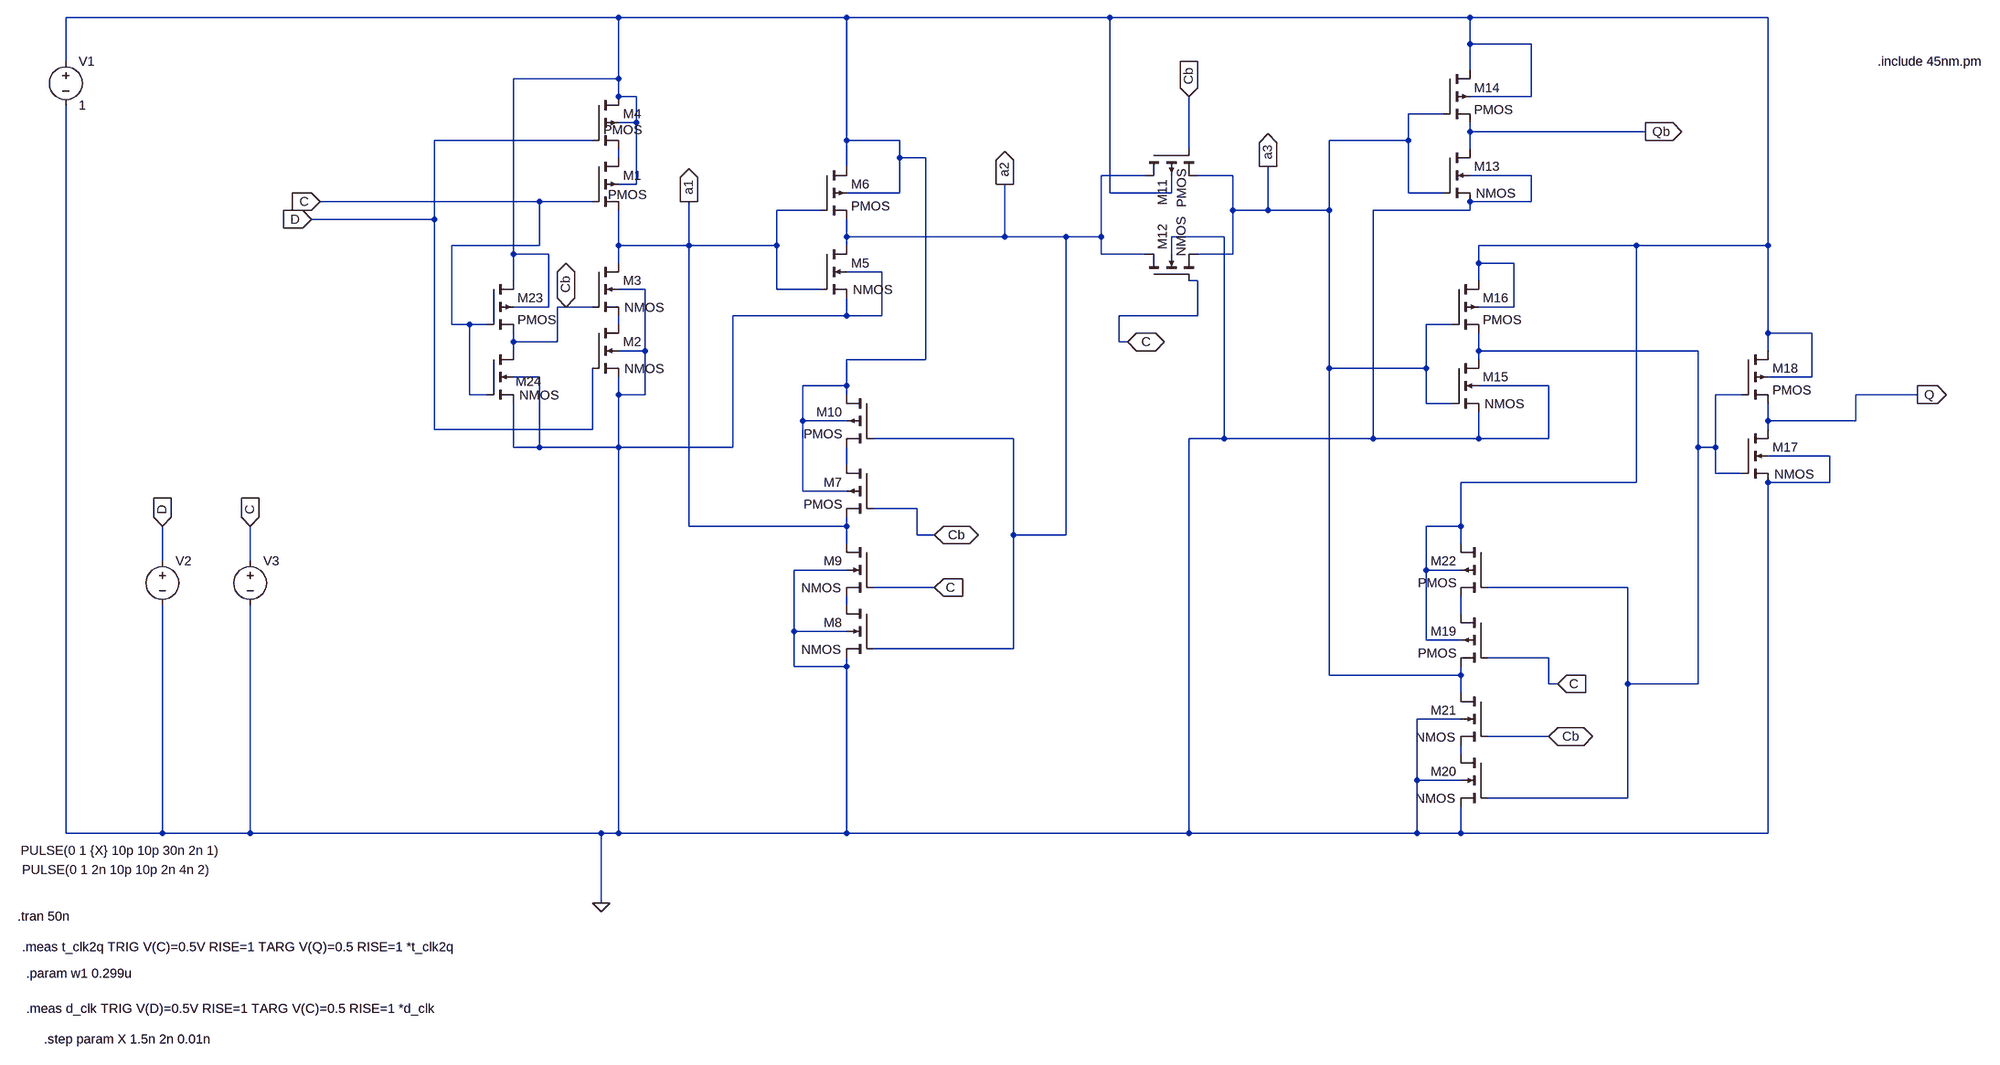
[diagram p0: schematic new1-setup.asc]
new1-setup.asc, the LTspice schematic file:
Version 4
SHEET 1 2344 680
WIRE -160 -1200 -1168 -1200
WIRE 256 -1200 -160 -1200
WIRE 736 -1200 256 -1200
WIRE 1392 -1200 736 -1200
WIRE 1936 -1200 1392 -1200
WIRE 1392 -1152 1392 -1200
WIRE 1504 -1152 1392 -1152
WIRE -1168 -1120 -1168 -1200
WIRE 1392 -1104 1392 -1152
WIRE -160 -1088 -160 -1200
WIRE -160 -1088 -352 -1088
WIRE -160 -1056 -160 -1088
WIRE -128 -1056 -160 -1056
WIRE 1504 -1056 1504 -1152
WIRE 1504 -1056 1392 -1056
WIRE 1344 -1024 1280 -1024
WIRE -128 -1008 -128 -1056
WIRE -128 -1008 -160 -1008
WIRE 1392 -992 1392 -1008
WIRE 1712 -992 1392 -992
WIRE -208 -976 -496 -976
WIRE 256 -976 256 -1200
WIRE 352 -976 256 -976
WIRE 1280 -976 1280 -1024
WIRE 1280 -976 1136 -976
WIRE 880 -960 880 -1056
WIRE 1392 -960 1392 -992
WIRE -160 -944 -160 -960
WIRE 352 -944 352 -976
WIRE 400 -944 352 -944
WIRE 256 -928 256 -976
WIRE 800 -912 720 -912
WIRE 960 -912 896 -912
WIRE 1504 -912 1392 -912
WIRE -128 -896 -128 -1008
WIRE -128 -896 -160 -896
WIRE 352 -880 352 -944
WIRE 352 -880 256 -880
WIRE 736 -880 736 -1200
WIRE 848 -880 848 -912
WIRE 848 -880 736 -880
WIRE 1280 -880 1280 -976
WIRE 1344 -880 1280 -880
WIRE -304 -864 -704 -864
WIRE -208 -864 -304 -864
WIRE 1504 -864 1504 -912
WIRE 1504 -864 1392 -864
WIRE 208 -848 128 -848
WIRE 960 -848 960 -912
WIRE 1024 -848 1024 -928
WIRE 1024 -848 960 -848
WIRE 1136 -848 1136 -976
WIRE 1136 -848 1024 -848
WIRE 1392 -848 1392 -864
WIRE 1392 -848 1216 -848
WIRE -496 -832 -496 -976
WIRE -496 -832 -720 -832
WIRE 256 -800 256 -832
WIRE 544 -800 544 -896
WIRE 544 -800 256 -800
WIRE 656 -800 544 -800
WIRE 720 -800 720 -912
WIRE 720 -800 656 -800
WIRE 944 -800 848 -800
WIRE -304 -784 -304 -864
WIRE -304 -784 -464 -784
WIRE -160 -784 -160 -848
WIRE -32 -784 -32 -864
WIRE -32 -784 -160 -784
WIRE 128 -784 128 -848
WIRE 128 -784 -32 -784
WIRE 256 -784 256 -800
WIRE 1696 -784 1408 -784
WIRE 1936 -784 1936 -1200
WIRE 1936 -784 1696 -784
WIRE -352 -768 -352 -1088
WIRE -288 -768 -352 -768
WIRE 720 -768 720 -800
WIRE 800 -768 720 -768
WIRE 848 -768 848 -800
WIRE 960 -768 960 -848
WIRE 960 -768 896 -768
WIRE -160 -752 -160 -784
WIRE 1408 -752 1408 -784
WIRE 1472 -752 1408 -752
WIRE 320 -736 256 -736
WIRE -352 -720 -352 -768
WIRE 896 -720 880 -720
WIRE 1408 -720 1408 -752
WIRE -112 -704 -160 -704
WIRE 128 -704 128 -784
WIRE 208 -704 128 -704
WIRE -288 -672 -288 -768
WIRE -288 -672 -352 -672
WIRE -256 -672 -272 -672
WIRE -208 -672 -256 -672
WIRE 1472 -672 1472 -752
WIRE 1472 -672 1408 -672
WIRE 256 -656 256 -688
WIRE 256 -656 48 -656
WIRE 320 -656 320 -736
WIRE 320 -656 256 -656
WIRE 896 -656 896 -720
WIRE 896 -656 752 -656
WIRE -464 -640 -464 -784
WIRE -432 -640 -464 -640
WIRE -400 -640 -432 -640
WIRE -160 -640 -160 -656
WIRE 1360 -640 1312 -640
WIRE 1936 -624 1936 -784
WIRE 2016 -624 1936 -624
WIRE -352 -608 -352 -624
WIRE -272 -608 -272 -672
WIRE -272 -608 -352 -608
WIRE 752 -608 752 -656
WIRE 768 -608 752 -608
WIRE -352 -592 -352 -608
WIRE -112 -592 -112 -704
WIRE -112 -592 -160 -592
WIRE 1408 -592 1408 -624
WIRE 1808 -592 1408 -592
WIRE 1936 -592 1936 -624
WIRE 400 -576 400 -944
WIRE 400 -576 256 -576
WIRE 1408 -576 1408 -592
WIRE 1136 -560 1136 -848
WIRE 1312 -560 1312 -640
WIRE 1312 -560 1136 -560
WIRE -304 -544 -352 -544
WIRE 2016 -544 2016 -624
WIRE 2016 -544 1936 -544
WIRE 256 -528 256 -576
WIRE 256 -528 176 -528
WIRE 1536 -528 1408 -528
WIRE -432 -512 -432 -640
WIRE -400 -512 -432 -512
WIRE -160 -512 -160 -544
WIRE -112 -512 -112 -592
WIRE -112 -512 -160 -512
WIRE 256 -512 256 -528
WIRE 1888 -512 1840 -512
WIRE 2208 -512 2096 -512
WIRE 1312 -496 1312 -560
WIRE 1360 -496 1312 -496
WIRE 176 -464 176 -528
WIRE 256 -464 176 -464
WIRE 1936 -464 1936 -496
WIRE 2096 -464 2096 -512
WIRE 2096 -464 1936 -464
WIRE -496 -448 -496 -832
WIRE -208 -448 -208 -560
WIRE -208 -448 -496 -448
WIRE 1936 -448 1936 -464
WIRE 560 -432 304 -432
WIRE 944 -432 944 -800
WIRE 944 -432 880 -432
WIRE 1216 -432 1216 -848
WIRE 1216 -432 944 -432
WIRE 1408 -432 1408 -480
WIRE 1408 -432 1216 -432
WIRE 1536 -432 1536 -528
WIRE 1536 -432 1408 -432
WIRE -352 -416 -352 -496
WIRE -304 -416 -304 -544
WIRE -304 -416 -352 -416
WIRE -160 -416 -160 -512
WIRE -160 -416 -304 -416
WIRE 48 -416 48 -656
WIRE 48 -416 -160 -416
WIRE 1808 -416 1808 -592
WIRE 1840 -416 1840 -512
WIRE 1840 -416 1808 -416
WIRE 2048 -400 1936 -400
WIRE 256 -384 256 -416
WIRE 1840 -368 1840 -416
WIRE 1888 -368 1840 -368
WIRE 1696 -352 1696 -784
WIRE 1696 -352 1376 -352
WIRE 2048 -352 2048 -400
WIRE 2048 -352 1936 -352
WIRE 176 -336 176 -464
WIRE 256 -336 176 -336
WIRE 384 -304 304 -304
WIRE -32 -272 -32 -784
WIRE 256 -272 256 -288
WIRE 256 -272 -32 -272
WIRE 1376 -272 1376 -352
WIRE 1376 -272 1312 -272
WIRE 384 -256 384 -304
WIRE 416 -256 384 -256
WIRE 560 -256 560 -432
WIRE 656 -256 656 -800
WIRE 656 -256 560 -256
WIRE 256 -240 256 -272
WIRE 1376 -240 1376 -272
WIRE -992 -208 -992 -272
WIRE -832 -208 -832 -272
WIRE 256 -192 160 -192
WIRE 1312 -192 1312 -272
WIRE 1376 -192 1312 -192
WIRE 416 -160 304 -160
WIRE 1680 -160 1424 -160
WIRE 256 -128 256 -144
WIRE 1376 -112 1376 -144
WIRE 160 -80 160 -192
WIRE 256 -80 160 -80
WIRE 1312 -64 1312 -192
WIRE 1376 -64 1312 -64
WIRE 560 -48 560 -256
WIRE 560 -48 304 -48
WIRE 1536 -32 1424 -32
WIRE 160 -16 160 -80
WIRE 256 -16 256 -32
WIRE 256 -16 160 -16
WIRE 1136 0 1136 -560
WIRE 1376 0 1376 -16
WIRE 1376 0 1136 0
WIRE 1536 16 1536 -32
WIRE 1552 16 1536 16
WIRE 1680 16 1680 -160
WIRE 1808 16 1808 -416
WIRE 1808 16 1680 16
WIRE 1376 32 1376 0
WIRE 1376 80 1296 80
WIRE 1536 112 1424 112
WIRE 1376 144 1376 128
WIRE 1296 192 1296 80
WIRE 1376 192 1296 192
WIRE 1680 224 1680 16
WIRE 1680 224 1424 224
WIRE -1168 288 -1168 -1040
WIRE -992 288 -992 -128
WIRE -992 288 -1168 288
WIRE -832 288 -832 -128
WIRE -832 288 -992 288
WIRE -192 288 -832 288
WIRE -160 288 -160 -416
WIRE -160 288 -192 288
WIRE 256 288 256 -16
WIRE 256 288 -160 288
WIRE 880 288 880 -432
WIRE 880 288 256 288
WIRE 1296 288 1296 192
WIRE 1296 288 880 288
WIRE 1376 288 1376 240
WIRE 1376 288 1296 288
WIRE 1936 288 1936 -352
WIRE 1936 288 1376 288
WIRE -192 416 -192 288
FLAG -192 416 0
FLAG -720 -832 D
IOPIN -720 -832 In
FLAG -704 -864 C
IOPIN -704 -864 In
FLAG 416 -160 C
IOPIN 416 -160 In
FLAG 1536 112 Cb
IOPIN 1536 112 BiDir
FLAG 880 -1056 Cb
IOPIN 880 -1056 In
FLAG 2208 -512 Q
IOPIN 2208 -512 Out
FLAG 1712 -992 Qb
IOPIN 1712 -992 Out
FLAG -992 -272 D
IOPIN -992 -272 In
FLAG -832 -272 C
IOPIN -832 -272 In
FLAG -32 -864 a1
IOPIN -32 -864 Out
FLAG 544 -896 a2
IOPIN 544 -896 Out
FLAG 1024 -928 a3
IOPIN 1024 -928 Out
FLAG -256 -672 Cb
IOPIN -256 -672 BiDir
FLAG 768 -608 C
IOPIN 768 -608 BiDir
FLAG 416 -256 Cb
IOPIN 416 -256 BiDir
FLAG 1552 16 C
IOPIN 1552 16 In
SYMBOL pmos4 -208 -944 R0
WINDOW 3 29 67 Left 2
SYMATTR InstName M1
SYMATTR Value2 l=45n w=w1
SYMBOL nmos4 -208 -640 R0
WINDOW 3 59 81 Left 2
SYMATTR InstName M2
SYMATTR Value2 l=45n w=0.2u
SYMBOL nmos4 -208 -752 R0
WINDOW 3 59 81 Left 2
SYMATTR InstName M3
SYMATTR Value2 l=45n w=0.2u
SYMBOL pmos4 -208 -1056 R0
WINDOW 3 20 61 Left 2
SYMATTR InstName M4
SYMATTR Value2 l=45n w=w1
SYMBOL nmos4 208 -784 R0
WINDOW 3 59 81 Left 2
SYMATTR InstName M5
SYMATTR Value2 l=45n w=0.2u
SYMBOL pmos4 208 -928 R0
SYMATTR InstName M6
SYMATTR Value2 l=45n w=0.4u
SYMBOL pmos4 304 -384 M0
SYMATTR InstName M7
SYMATTR Value2 l=45n w=w1
SYMBOL nmos4 304 -128 M0
WINDOW 3 59 81 Left 2
SYMATTR InstName M8
SYMATTR Value2 l=45n w=0.2u
SYMBOL nmos4 304 -240 M0
WINDOW 3 59 81 Left 2
SYMATTR InstName M9
SYMATTR Value2 l=45n w=0.2u
SYMBOL pmos4 304 -512 M0
SYMATTR InstName M10
SYMATTR Value2 l=45n w=w1
SYMBOL pmos4 800 -960 M90
WINDOW 3 37 67 Left 2
SYMATTR InstName M11
SYMATTR Value2 l=45n w=0.4u
SYMBOL nmos4 800 -720 R270
WINDOW 3 44 66 Left 2
SYMATTR InstName M12
SYMATTR Value2 l=45n w=0.2u
SYMBOL nmos4 1344 -960 R0
WINDOW 3 59 81 Left 2
SYMATTR InstName M13
SYMATTR Value2 l=45n w=0.2u
SYMBOL pmos4 1344 -1104 R0
SYMATTR InstName M14
SYMATTR Value2 l=45n w=0.4u
SYMBOL nmos4 1360 -576 R0
WINDOW 3 59 81 Left 2
SYMATTR InstName M15
SYMATTR Value2 l=45n w=0.2u
SYMBOL pmos4 1360 -720 R0
SYMATTR InstName M16
SYMATTR Value2 l=45n w=0.296u
SYMBOL nmos4 1888 -448 R0
WINDOW 3 59 81 Left 2
SYMATTR InstName M17
SYMATTR Value2 l=45n w=0.2u
SYMBOL pmos4 1888 -592 R0
SYMATTR InstName M18
SYMATTR Value2 l=45n w=0.4u
SYMBOL pmos4 1424 -112 M0
SYMATTR InstName M19
SYMATTR Value2 l=45n w=w1
SYMBOL nmos4 1424 144 M0
WINDOW 3 59 81 Left 2
SYMATTR InstName M20
SYMATTR Value2 l=45n w=0.2u
SYMBOL nmos4 1424 32 M0
WINDOW 3 59 81 Left 2
SYMATTR InstName M21
SYMATTR Value2 l=45n w=0.2u
SYMBOL pmos4 1424 -240 M0
SYMATTR InstName M22
SYMATTR Value2 l=45n w=w1
SYMBOL voltage -1168 -1136 R0
WINDOW 123 0 0 Left 0
WINDOW 39 0 0 Left 0
SYMATTR InstName V1
SYMATTR Value 1
SYMBOL voltage -992 -224 R0
WINDOW 3 -258 544 Left 2
WINDOW 123 0 0 Left 0
WINDOW 39 0 0 Left 0
SYMATTR Value PULSE(0 1 {X} 10p 10p 30n 2n 1)
SYMATTR InstName V2
SYMBOL voltage -832 -224 R0
WINDOW 3 -416 579 Left 2
WINDOW 123 0 0 Left 0
WINDOW 39 0 0 Left 0
SYMATTR Value PULSE(0 1 2n 10p 10p 2n 4n 2)
SYMATTR InstName V3
SYMBOL pmos4 -400 -720 R0
SYMATTR InstName M23
SYMATTR Value2 l=45n w=0.4u
SYMBOL nmos4 -400 -592 R0
WINDOW 0 52 56 Left 2
WINDOW 3 59 81 Left 2
SYMATTR InstName M24
SYMATTR Value2 l=45n w=0.2u
TEXT 2136 -1120 Left 2 !.include 45nm.pm
TEXT -1256 440 Left 2 !.tran 50n
TEXT -1248 496 Left 2 !.meas t_clk2q TRIG V(C)=0.5V RISE=1 TARG V(Q)=0.5 RISE=1 *t_clk2q
TEXT -1240 544 Left 2 !.param w1 0.299u
TEXT -1240 608 Left 2 !.meas d_clk TRIG V(D)=0.5V RISE=1 TARG V(C)=0.5 RISE=1 *d_clk
TEXT -1208 664 Left 2 !.step param X 1.5n 2n 0.01n

The netlist it stands for:
* new1-setup.asc
M1 N002 C a1 N001 PMOS l=45n w=w1
M2 N003 D 0 0 NMOS l=45n w=0.2u
M3 a1 Cb N003 0 NMOS l=45n w=0.2u
M4 N001 D N002 N001 PMOS l=45n w=w1
M5 a2 a1 0 0 NMOS l=45n w=0.2u
M6 N001 a1 a2 N001 PMOS l=45n w=0.4u
M7 N005 Cb a1 N001 PMOS l=45n w=w1
M8 N006 a2 0 0 NMOS l=45n w=0.2u
M9 a1 C N006 0 NMOS l=45n w=0.2u
M10 N001 a2 N005 N001 PMOS l=45n w=w1
M11 a2 Cb a3 N001 PMOS l=45n w=0.4u
M12 a2 C a3 0 NMOS l=45n w=0.2u
M13 Qb a3 0 0 NMOS l=45n w=0.2u
M14 N001 a3 Qb N001 PMOS l=45n w=0.4u
M15 N004 a3 0 0 NMOS l=45n w=0.2u
M16 N001 a3 N004 N001 PMOS l=45n w=0.296u
M17 Q N004 0 0 NMOS l=45n w=0.2u
M18 N001 N004 Q N001 PMOS l=45n w=0.4u
M19 N007 C a3 N001 PMOS l=45n w=w1
M20 N008 N004 0 0 NMOS l=45n w=0.2u
M21 a3 Cb N008 0 NMOS l=45n w=0.2u
M22 N001 N004 N007 N001 PMOS l=45n w=w1
V1 N001 0 1
V2 D 0 PULSE(0 1 {X} 10p 10p 30n 2n 1)
V3 C 0 PULSE(0 1 2n 10p 10p 2n 4n 2)
M23 N001 C Cb N001 PMOS l=45n w=0.4u
M24 Cb C 0 0 NMOS l=45n w=0.2u
.model NMOS NMOS
.model PMOS PMOS
.lib standard.mos
.include 45nm.pm
.tran 50n
.meas t_clk2q TRIG V(C)=0.5V RISE=1 TARG V(Q)=0.5 RISE=1 *t_clk2q
.param w1 0.299u
.meas d_clk TRIG V(D)=0.5V RISE=1 TARG V(C)=0.5 RISE=1 *d_clk
.step param X 1.5n 2n 0.01n
.backanno
.end